# Altium schematic sheet 智能颜色传感器模块.SCHDOC
size A4
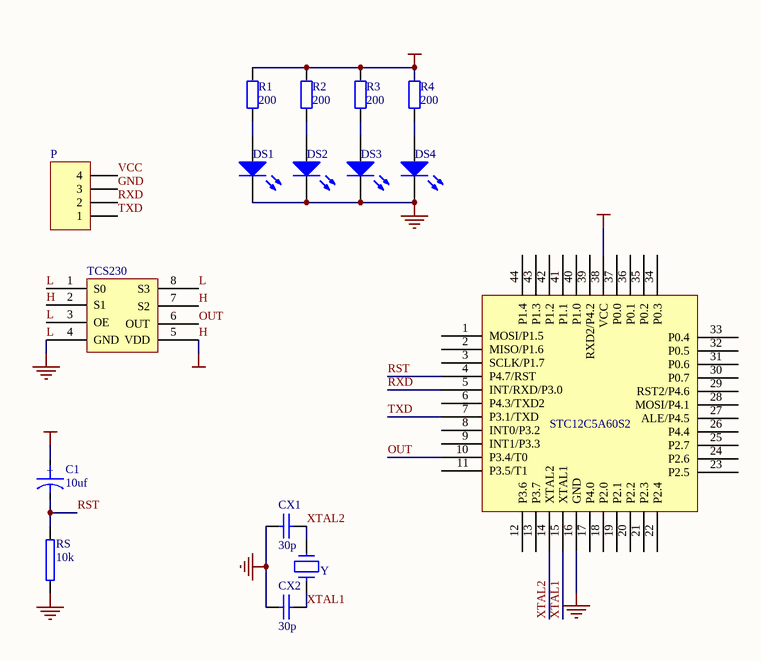
[diagram p0: 智能颜色传感器模块.SCHDOC]

## Parts
C1  10uf  [10uf]
CX1  30p  [TP-0805-R]
CX2  30p  [TP-0805-R]
DS1  LED1  [LED_5]  (value not drawn)
DS2  LED1  [LED_5]  (value not drawn)
DS3  LED1  [LED_5]  (value not drawn)
DS4  LED1  [LED_5]  (value not drawn)
P  (no value)  [HDR-4]
R1  value 200  [TP-0805-R]  (hidden comment: Res2)
R2  value 200  [TP-0805-R]  (hidden comment: Res2)
R3  value 200  [TP-0805-R]  (hidden comment: Res2)
R4  value 200  [TP-0805-R]  (hidden comment: Res2)
RS  10k  [TP-0805-R]
STC12C5A60S2  (no value)  [STC12C5A60S2]
TCS230  (no value)  [CDFP-8]
Y1  Y  [JZ_ZC]

## Nets
GND: CX1.2 CX2.2 DS1.2(K) DS2.2(K) DS3.2(K) DS4.2(K) P.3 RS.1 STC12C5A60S2.16(GND) TCS230.1(S0) TCS230.3(OE) TCS230.4(GND) TCS230.8(S3)  [also labelled L]
H: C1.1 P.4 R1.2 R2.2 R3.2 R4.2 STC12C5A60S2.38(VCC) TCS230.2(S1) TCS230.5(VDD) TCS230.7(S2)  [also labelled VCC]
OUT: STC12C5A60S2.10(P3.4/T0) TCS230.6(OUT)
RST: C1.2 RS.2 STC12C5A60S2.4(P4.7/RST)
RXD: P.2 STC12C5A60S2.5(INT/RXD/P3.0)
TXD: P.1 STC12C5A60S2.7(P3.1/TXD)
XTAL1: CX2.1 STC12C5A60S2.15(XTAL1) Y1.1
XTAL2: CX1.1 STC12C5A60S2.14(XTAL2) Y1.2
NetDS1_1: DS1.1(A) R1.1
NetDS2_1: DS2.1(A) R2.1
NetDS3_1: DS3.1(A) R3.1
NetDS4_1: DS4.1(A) R4.1

Not connected (* = marked no-connect by the designer): STC12C5A60S2 1(MOSI/P1.5) 2(MISO/P1.6) 3(SCLK/P1.7) 6(P4.3/TXD2) 8(INT0/P3.2) 9(INT1/P3.3) 11(P3.5/T1) 12(P3.6) 13(P3.7) 17(P4.0) 18(P2.0) 19(P2.1) 20(P2.2) 21(P2.3) 22(P2.4) 23(P2.5) 24(P2.6) 25(P2.7) 26(P4.4) 27(ALE/P4.5) 28(MOSI/P4.1) 29(RST2/P4.6) 30(P0.7) 31(P0.6) 32(P0.5) 33(P0.4) 34(P0.3) 35(P0.2) 36(P0.1) 37(P0.0) 39(RXD2/P4.2) 40(P1.0) 41(P1.1) 42(P1.2) 43(P1.3) 44(P1.4)

## Notes on the sheet
- (in symbol CAPACITOR POL) +

## Library data of the parts
C1 = CAPACITOR POL: Capacitor
CX1 CX2 = CAP: Capacitor
DS1-DS4 = LED1: Typical RED GaAs LED; Published: 8-Jun-2000; LatestRevisionDate: 17-Jul-2002; LatestRevisionNote: Re-released for DXP Platform.; Publisher: Altium Limited
P = PZ_4: 排针——4; LatestRevisionDate: 17-Jul-2002; LatestRevisionNote: Re-released for DXP Platform.; Publisher: Altium Limited
R1-R4 = Res2: Resistor; Published: 8-Jun-2000; LatestRevisionDate: 17-Jul-2002; LatestRevisionNote: Re-released for DXP Platform.; Publisher: Altium Limited
RS = RES2
STC12C5A60S2 = STC12C5A60S2_LQFP
TCS230 = TCS230: 颜色识别传感器
Y1 = CRYSTAL